# EAGLE design HUB_HEAD (EAGLE 7.6.0)
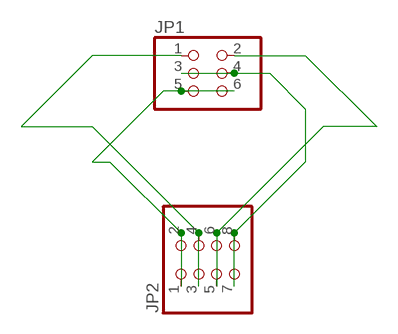
[diagram p0: schematic, sheet 1]

## Parts
JP1  PINHD-2X3  [2X03]
JP2  PINHD-2X4  [2X04]

## Nets
N$2: JP1.1 JP2.3 JP2.4
N$3: JP1.2 JP2.5 JP2.6
N$7: JP1.3 JP1.4 JP2.7 JP2.8
N$8: JP1.5 JP1.6 JP2.1 JP2.2

## Library data of the parts
JP1 = pinhead:PINHD-2X3: PIN HEADER
JP2 = pinhead:PINHD-2X4: PIN HEADER

## Board
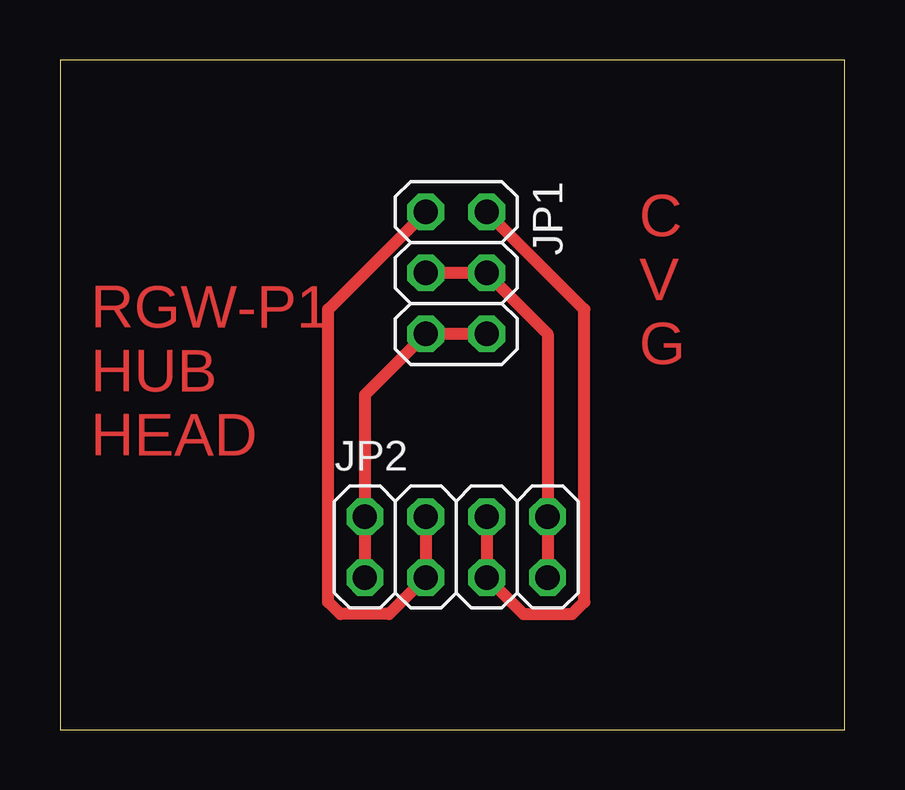
[diagram p1: board, top side]

Size 32.69 x 27.93 mm. Coordinates in mm from the lower left corner, seen from the top.
Outline: 0,0 32.69,0 32.69,27.93 0,27.93 0,0
Copper layers (1*16): Top 0.035mm / dielectric 1.5mm / Bottom 0.035mm
Design rules "default": minimum track width 10mil, minimum drill 24mil, track to track 8mil, track to pad 8mil, pad to pad 8mil, via to via 8mil, smd to smd 8mil, copper to edge 40mil, drill to drill 8mil, minimum pad ring 10mil, minimum via ring 8mil, stop-mask expansion 4mil, vias tented up to drill 0mil, thermal gap 10mil

### Footprints (pad centres in the part's own frame; a part is rotated, then mirrored left to right if it is on the bottom)
2X03 = drill 1.016 octagon: 1 -2.54,-1.27; 2 -2.54,1.27; 3 0,-1.27; 4 0,1.27; 5 2.54,-1.27; 6 2.54,1.27
2X04 = drill 1.016 octagon: 1 -3.81,-1.27; 2 -3.81,1.27; 3 -1.27,-1.27; 4 -1.27,1.27; 5 1.27,-1.27; 6 1.27,1.27; 7 3.81,-1.27; 8 3.81,1.27

### Placement (x,y rotation side)
JP1  16.51,19.05 270 top
JP2  16.51,7.62 0 top

### Tracks (layer width: path | path; a pad name or v marks a point on that pad's centre or on a via)
N$2
  Top 0.508: JP2.4 JP2.3 13.72,4.83 11.68,4.83 11.18,5.33 11.18,17.53 JP1.1
N$3
  Top 0.508: JP2.6 JP2.5 19.3,4.83 21.34,4.83 21.84,5.33 21.84,17.53 JP1.2
N$7
  Top 0.508: JP2.7 JP2.8 20.32,16.51 JP1.4 JP1.3
N$8
  Top 0.508: JP2.1 JP2.2 12.7,13.97 JP1.5 JP1.6

### Text on the board
Top: C / V / G | RGW-P1 / HUB / HEAD